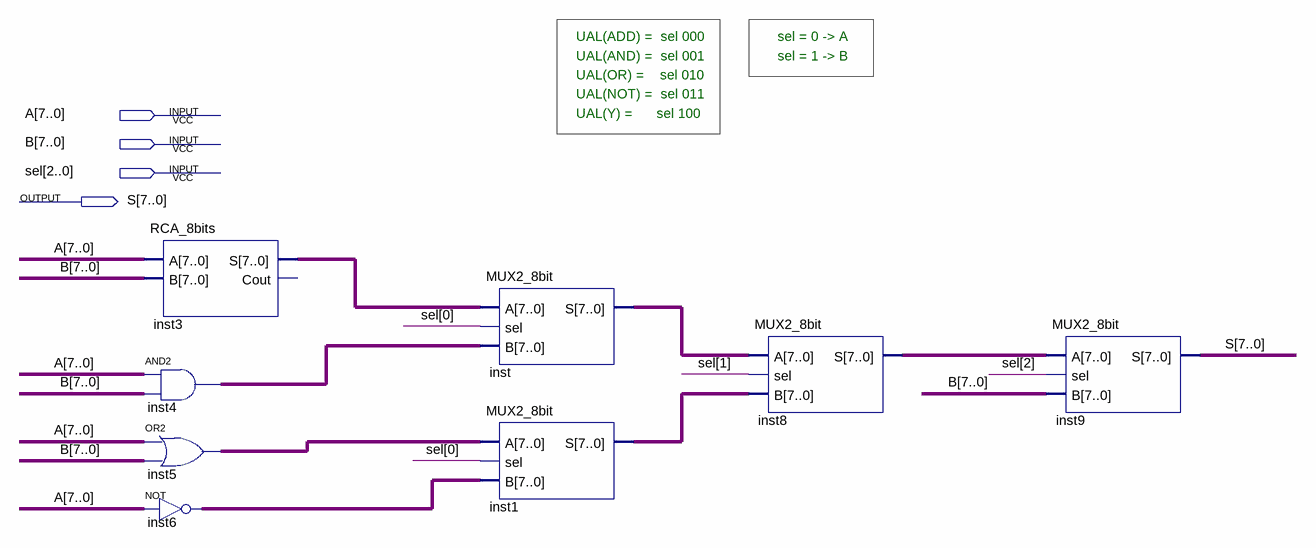
[diagram p0: schematic sheet]
// Quartus schematic ULA.bdf as structural Verilog: 8 symbols, 4 pins
module ULA (
  input  [7:0] A,
  input  [7:0] B,
  input  [2:0] sel,
  output [7:0] S
);

  wire [7:0] inst1_s, inst3_s, inst4_out, inst5_out, inst6_out, inst8_s, inst_s;

  RCA_8bits inst3 (.A(A), .B(B), .S(inst3_s));  // open: Cout
  assign inst4_out = A & B;  // AND2 inst4, 8 bits wide
  assign inst5_out = A | B;  // OR2 inst5, 8 bits wide
  assign inst6_out = ~A;  // NOT inst6, 8 bits wide
  MUX2_8bit inst (.A(inst3_s), .sel(sel[0]), .B(inst4_out), .S(inst_s));
  MUX2_8bit inst1 (.A(inst5_out), .sel(sel[0]), .B(inst6_out), .S(inst1_s));
  MUX2_8bit inst8 (.A(inst_s), .sel(sel[1]), .B(inst1_s), .S(inst8_s));
  MUX2_8bit inst9 (.A(inst8_s), .sel(sel[2]), .B(B), .S(S));

  // Notes on the sheet:
  //   UAL(ADD) =  sel 000
  //   sel = 0 -> A
  //   UAL(AND) =  sel 001
  //   sel = 1 -> B
  //   UAL(OR) =    sel 010
  //   UAL(NOT) =  sel 011
  //   UAL(Y) =      sel 100
endmodule
